# Altium schematic sheet Main.SchDoc
size A3; SheetNumber: 1; SheetTotal: 1
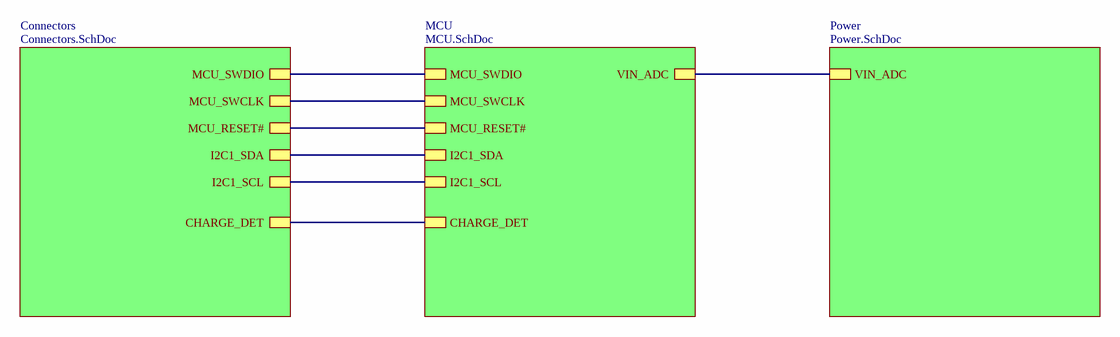
[diagram p0: Main.SchDoc]

## Sub-sheets
Connectors = Connectors.SchDoc: MCU_SWDIO, MCU_SWCLK, MCU_RESET#, CHARGE_DET, I2C1_SDA, I2C1_SCL
MCU = MCU.SchDoc: MCU_SWDIO, MCU_SWCLK, MCU_RESET#, VIN_ADC, CHARGE_DET, I2C1_SDA, I2C1_SCL
Power = Power.SchDoc: VIN_ADC

## Nets
(unnamed): sheet Connectors/MCU_SWDIO, sheet MCU/MCU_SWDIO
(unnamed): sheet Connectors/MCU_SWCLK, sheet MCU/MCU_SWCLK
(unnamed): sheet Connectors/MCU_RESET#, sheet MCU/MCU_RESET#
(unnamed): sheet Connectors/CHARGE_DET, sheet MCU/CHARGE_DET
(unnamed): sheet Connectors/I2C1_SDA, sheet MCU/I2C1_SDA
(unnamed): sheet Connectors/I2C1_SCL, sheet MCU/I2C1_SCL
(unnamed): sheet MCU/VIN_ADC, sheet Power/VIN_ADC